# Altium schematic sheet jlink_f72.SchDoc
size A4; DocumentNumber: 3; SheetNumber: 3; SheetTotal: 4
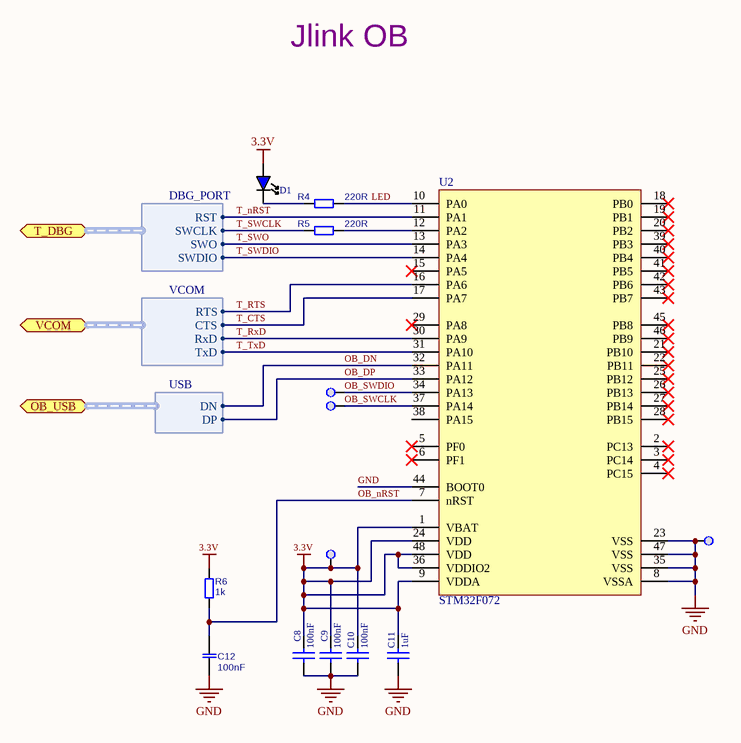
[diagram p0: jlink_f72.SchDoc]

## Parts
C8  100nF  [C0402]
C9  100nF  [C0402]
C10  100nF  [C0402]
C11  1uF  [C0603]
C12  100nF  [C0402]
D1  Debugger LED  [LED0603]  (value not drawn)
R4  220R  [R0402]
R5  220R  [R0402]
R6  1k  [R0402]
TP1  TestPoint  [PAD1_07]  (value not drawn)  (no BOM)
TP2  TestPoint  [PAD1_07]  (value not drawn)  (no BOM)
TP3  TestPoint  [PAD1_07]  (value not drawn)  (no BOM)
TP4  TestPoint  [PAD1_07]  (value not drawn)  (no BOM)
U2  STM32F072  [LQFP48_M]

## Ports
OB_USB (harness USB), T_DBG (harness DBG_PORT), VCOM (harness VCOM)

## Harnesses
DBG_PORT: RST, SWCLK, SWDIO, SWO
VCOM: RTS, CTS, RxD, TxD
USB: DP, DN

## Nets
3.3V: C8.1 C9.1 C10.1 C11.1 D1.A R6.1(K) TP4.1 U2.1(VBAT) U2.9(VDDA) U2.24(VDD) U2.36(VDDIO2) U2.48(VDD)
GND: C8.2 C9.2 C10.2 C11.2 C12.1(K) TP3.1 U2.8(VSSA) U2.23(VSS) U2.35(VSS) U2.44(BOOT0) U2.47(VSS)
LED: R4.1(K) U2.10(PA0)
OB_DN: U2.32(PA11) ; port OB_USB.DN
OB_DP: U2.33(PA12) ; port OB_USB.DP
OB_nRST: C12.2(A) R6.2(A) U2.7(nRST)
OB_SWCLK: TP2.1 U2.37(PA14)
OB_SWDIO: TP1.1 U2.34(PA13)
T_CTS: U2.17(PA7) ; port VCOM.CTS
T_nRST: U2.11(PA1) ; port T_DBG.RST
T_RTS: U2.16(PA6) ; port VCOM.RTS
T_RxD: U2.30(PA9) ; port VCOM.RxD
T_SWCLK: R5.2(A) ; port T_DBG.SWCLK
T_SWDIO: U2.14(PA4) ; port T_DBG.SWDIO
T_SWO: U2.13(PA3) ; port T_DBG.SWO
T_TxD: U2.31(PA10) ; port VCOM.TxD
NetD1_k: D1.k R4.2(A)
NetR5_1: R5.1(K) U2.12(PA2)

Not connected (* = marked no-connect by the designer): U2 2(PC13)* 3(PC14)* 4(PC15)* 5(PF0)* 6(PF1)* 15(PA5)* 18(PB0)* 19(PB1)* 20(PB2)* 21(PB10)* 22(PB11)* 25(PB12)* 26(PB13)* 27(PB14)* 28(PB15)* 29(PA8)* 38(PA15) 39(PB3)* 40(PB4)* 41(PB5)* 42(PB6)* 43(PB7)* 45(PB8)* 46(PB9)*

## Notes on the sheet
- Jlink OB

## Library data of the parts
C8-C11 = Cap: Capacitor; Published: 8-Jun-2000; LatestRevisionDate: 17-Jul-2002; LatestRevisionNote: Re-released for DXP Platform.; PackageReference: RAD-0.3; Publisher: Altium Limited; PackageDescription: Radial Cap, Thru-Hole; 2 Leads; 0.3 in Pin Spacing
  C8-C10: Value: 100nF
  C11: Value: 1uF
C12 = Cap: Ceramic Capacitor; Type: SMD; ComponentLink1URL: *; ComponentLink1Description: *; Tolerance: *; Value: 100nF
D1 = LED_BLUE: RED LED; Value: *
R4-R6 = Res: Resistor; ComponentLink1URL: *; ComponentLink1Description: *; Tolerance: *; Type: SMD
  R4 R5: Value: 220R
  R6: Value: 1k
TP1-TP4 = TestPoint: Test point
U2 = STM32F072: Cortex-M0 MCU